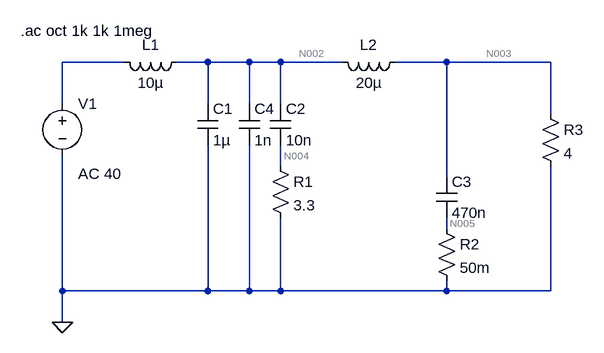
[diagram p0: schematic OutputFilt.asc]
OutputFilt.asc, the LTspice schematic file:
Version 4
SHEET 1 880 680
WIRE 128 96 32 96
WIRE 256 96 208 96
WIRE 320 96 256 96
WIRE 368 96 320 96
WIRE 464 96 368 96
WIRE 624 96 544 96
WIRE 784 96 624 96
WIRE 32 160 32 96
WIRE 256 160 256 96
WIRE 320 160 320 96
WIRE 368 160 368 96
WIRE 784 176 784 96
WIRE 368 256 368 224
WIRE 624 272 624 96
WIRE 624 352 624 336
WIRE 32 448 32 240
WIRE 256 448 256 224
WIRE 256 448 32 448
WIRE 320 448 320 224
WIRE 320 448 256 448
WIRE 368 448 368 336
WIRE 368 448 320 448
WIRE 624 448 624 432
WIRE 624 448 368 448
WIRE 784 448 784 256
WIRE 784 448 624 448
WIRE 32 496 32 448
FLAG 32 496 0
SYMBOL voltage 32 144 R0
WINDOW 123 24 124 Left 2
WINDOW 39 0 0 Left 0
SYMATTR InstName V1
SYMATTR Value ""
SYMATTR Value2 AC 40
SYMBOL ind 224 80 R90
WINDOW 0 5 56 VBottom 2
WINDOW 3 32 56 VTop 2
SYMATTR InstName L1
SYMATTR Value 10µ
SYMATTR SpiceLine Rser=50m
SYMBOL cap 240 160 R0
SYMATTR InstName C1
SYMATTR Value 1µ
SYMBOL cap 352 160 R0
SYMATTR InstName C2
SYMATTR Value 10n
SYMBOL res 352 240 R0
SYMATTR InstName R1
SYMATTR Value 3.3
SYMBOL ind 560 80 R90
WINDOW 0 5 56 VBottom 2
WINDOW 3 32 56 VTop 2
SYMATTR InstName L2
SYMATTR Value 20µ
SYMATTR SpiceLine Rser=50m
SYMBOL cap 608 272 R0
SYMATTR InstName C3
SYMATTR Value 470n
SYMBOL res 608 336 R0
SYMATTR InstName R2
SYMATTR Value 50m
SYMBOL cap 304 160 R0
SYMATTR InstName C4
SYMATTR Value 1n
SYMBOL res 768 160 R0
SYMATTR InstName R3
SYMATTR Value 4
TEXT -32 48 Left 2 !.ac oct 1k 1k 1meg

The netlist it stands for:
* OutputFilt.asc
V1 N001 0 AC 40
L1 N002 N001 10µ Rser=50m
C1 N002 0 1µ
C2 N002 N004 10n
R1 N004 0 3.3
L2 N003 N002 20µ Rser=50m
C3 N003 N005 470n
R2 N005 0 50m
C4 N002 0 1n
R3 N003 0 4
.ac oct 1k 1k 1meg
.backanno
.end

* Results of the author's LTspice run, read from the files saved beside the schematic
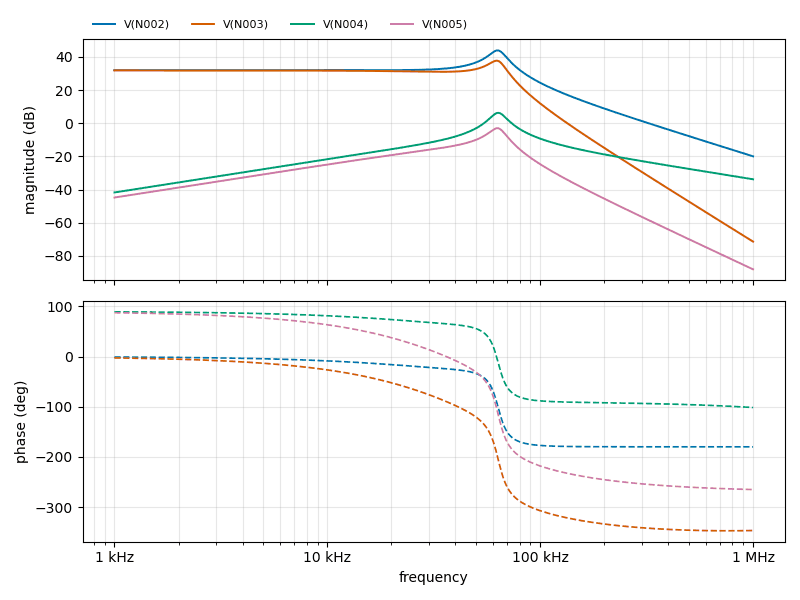
[diagram p1: AC Analysis of OutputFilt.asc, plotted from the saved traces]
* AC Analysis, 1 run:
*   V(N002): 31.93 dB at 1 kHz, -19.94 dB at 1 MHz, peak 43.89 dB at 63.03 kHz, 3 dB below the peak at 57.33 kHz and 68.09 kHz
*   V(N003): 31.83 dB at 1 kHz, -71.36 dB at 1 MHz, peak 37.69 dB at 62.42 kHz, 3 dB below the peak at 55.46 kHz and 67.2 kHz
*   V(N004): -41.73 dB at 1 kHz, -33.79 dB at 1 MHz, peak 6.25 dB at 63.47 kHz, 3 dB below the peak at 58.32 kHz and 68.91 kHz
*   V(N005): -44.79 dB at 1 kHz, -88.07 dB at 1 MHz, peak -2.99 dB at 62.9 kHz, 3 dB below the peak at 57.07 kHz and 67.85 kHz